# Altium schematic sheet [1] - Schematic Blcoks.SchDoc
size 431 x 279 mm; SheetNumber: 1; SheetTotal: 6
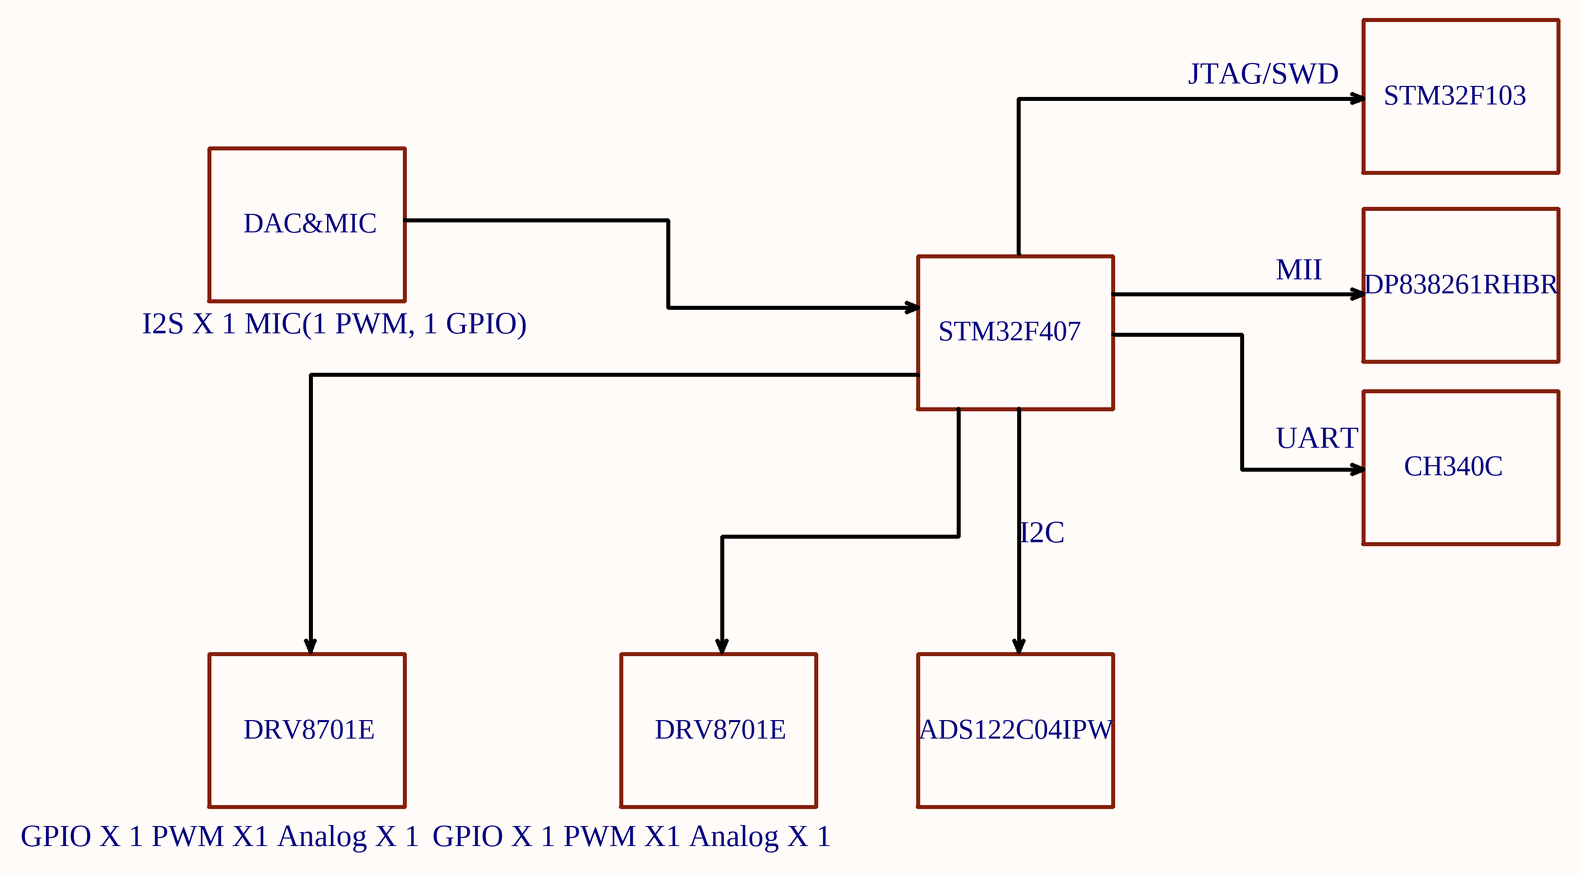
[diagram p0: [1] - Schematic Blcoks.SchDoc]

## Notes on the sheet
- JTAG/SWD
- STM32F103
- DAC&MIC
- I2S X 1 MIC(1 PWM, 1 GPIO)
- MII
- DP838261RHBR
- STM32F407
- UART
- CH340C
- I2C
- DRV8701E
- ADS122C04IPW
- GPIO X 1 PWM X1 Analog X 1
- DWG. NO.
- REV.
- SHT.
- THIS DOCUMENT AND THE DATA DISCLOSED HEREIN OR HEREWITH IS THE PROPERTY OF ALTIUM LIMITED AND MAY BE FREELY DISTRIBUTED IN WHOLE. NO RIGHTS ARE RESERVED OR EXPRESS OR IMPLIED WARANTEE GIVEN.
- REVISION
- DESCRIPTION
- DATE
- APPROVED
- ENG:
- APPROVALS
- PROJECT
- DSN:
- CHK:
- REFERENCE DOCUMENTS
- PROJECT REVISION:
- TITLE
- DOCUMENT REVISION:
- DESIGN ITEM:
- BOM:
- FAB DWG:
- PCB DWG:
- ASSY DWG:
- SCALE:
- SIZE
- B
- CAGE CODE
- FILE NAME
- DWG NO.
- SHEET
- OF
- REV